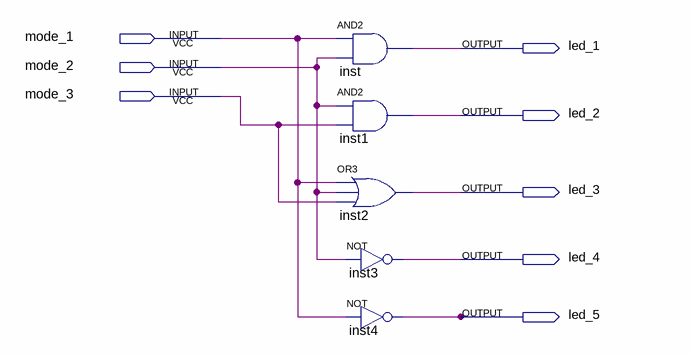
[diagram p0: schematic sheet]
// Quartus schematic CycloneIII.bdf as structural Verilog: 5 symbols, 8 pins
module CycloneIII (
  input  mode_1,
  input  mode_2,
  input  mode_3,
  output led_1,
  output led_2,
  output led_3,
  output led_4,
  output led_5
);

  and inst (led_1, mode_1, mode_2);
  and inst1 (led_2, mode_2, mode_3);
  or inst2 (led_3, mode_1, mode_2, mode_3);
  not inst3 (led_4, mode_2);
  not inst4 (led_5, mode_1);
endmodule
